# Altium schematic sheet Solenoid_Driver.SchDoc
size Letter; Organization: Altium Limited; Address1: L3, 12a Rodborough Rd; Address2: Frenchs Forest; Address3: NSW; Address4: Australia 2086
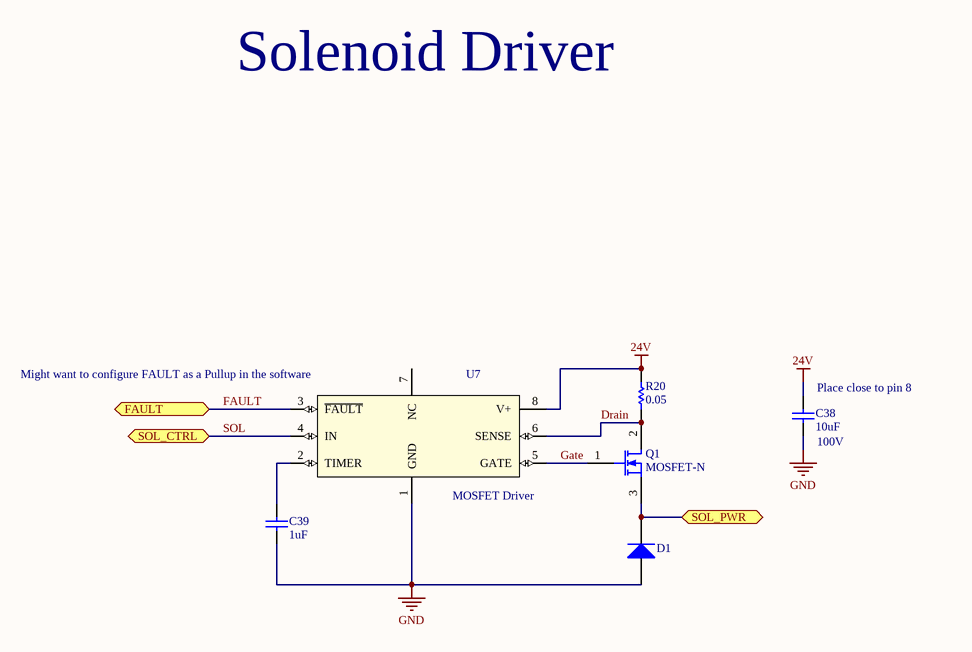
[diagram p0: Solenoid_Driver.SchDoc]

## Parts
C38  value 10uF  Voltage: 100V  [1206]  (hidden comment: Cap)
C39  value 1uF  [0603]  (hidden comment: Cap)
D1  Diode  [SMC]  (value not drawn)
Q1  MOSFET-N  [DPAK2]
R20  value 0.05  [0603]  (hidden comment: Res1)
U7  MOSFET Driver  [PSO-8]

## Ports
FAULT (bidir), SOL_CTRL (bidir), SOL_PWR (bidir)

## Nets
24V: C38.2 R20.2 U7.8(V+)
GND: C38.1 C39.1 D1.1(A) U7.1(GND)
Drain: Q1.2(D) R20.1 U7.6(SENSE)
FAULT: U7.3(~{FAULT}) ; port FAULT
Gate: Q1.1(G) U7.5(GATE)
SOL: U7.4(IN) ; port SOL_CTRL
SOL_PWR: D1.2(K) Q1.3(S) ; port SOL_PWR
NetC39_2: C39.2 U7.2(TIMER)

Not connected (* = marked no-connect by the designer): U7 7(NC)

## Notes on the sheet
- Solenoid Driver
- (near U7) Might want to configure FAULT as a Pullup in the software
- (near C38) Place close to pin 8
- Title
- Size:
- Date:
- Letter
- Number:
- Time:
- Revision:
- Sheet
- of
- File:

## Library data of the parts
C38 C39 = Cap: Capacitor
D1 = Diode: Default Diode
Q1 = MOSFET-N: N-Channel MOSFET; DigiKey PN: IRFZ34NSTRLPBFCT-ND; ComponentLink1Description: DigiKey URL; ComponentLink1URL: https://www.digikey.com/product-detail/en/infineon-technologies/IRFZ34NSTRLPBF/IRFZ34NSTRLPBFCT-ND/2441060
R20 = Res1: Resistor
U7 = LT1910ES8#PBF: Vendor: Linear Technology; Manufacturer_Part_Number: lt1910es8#pbf; Value: Value; Type: Type; RefDes: RefDes; DigiKey PN: LT1910ES8#TRPBFCT-ND